# Altium project CAN2XG.PrjPcb
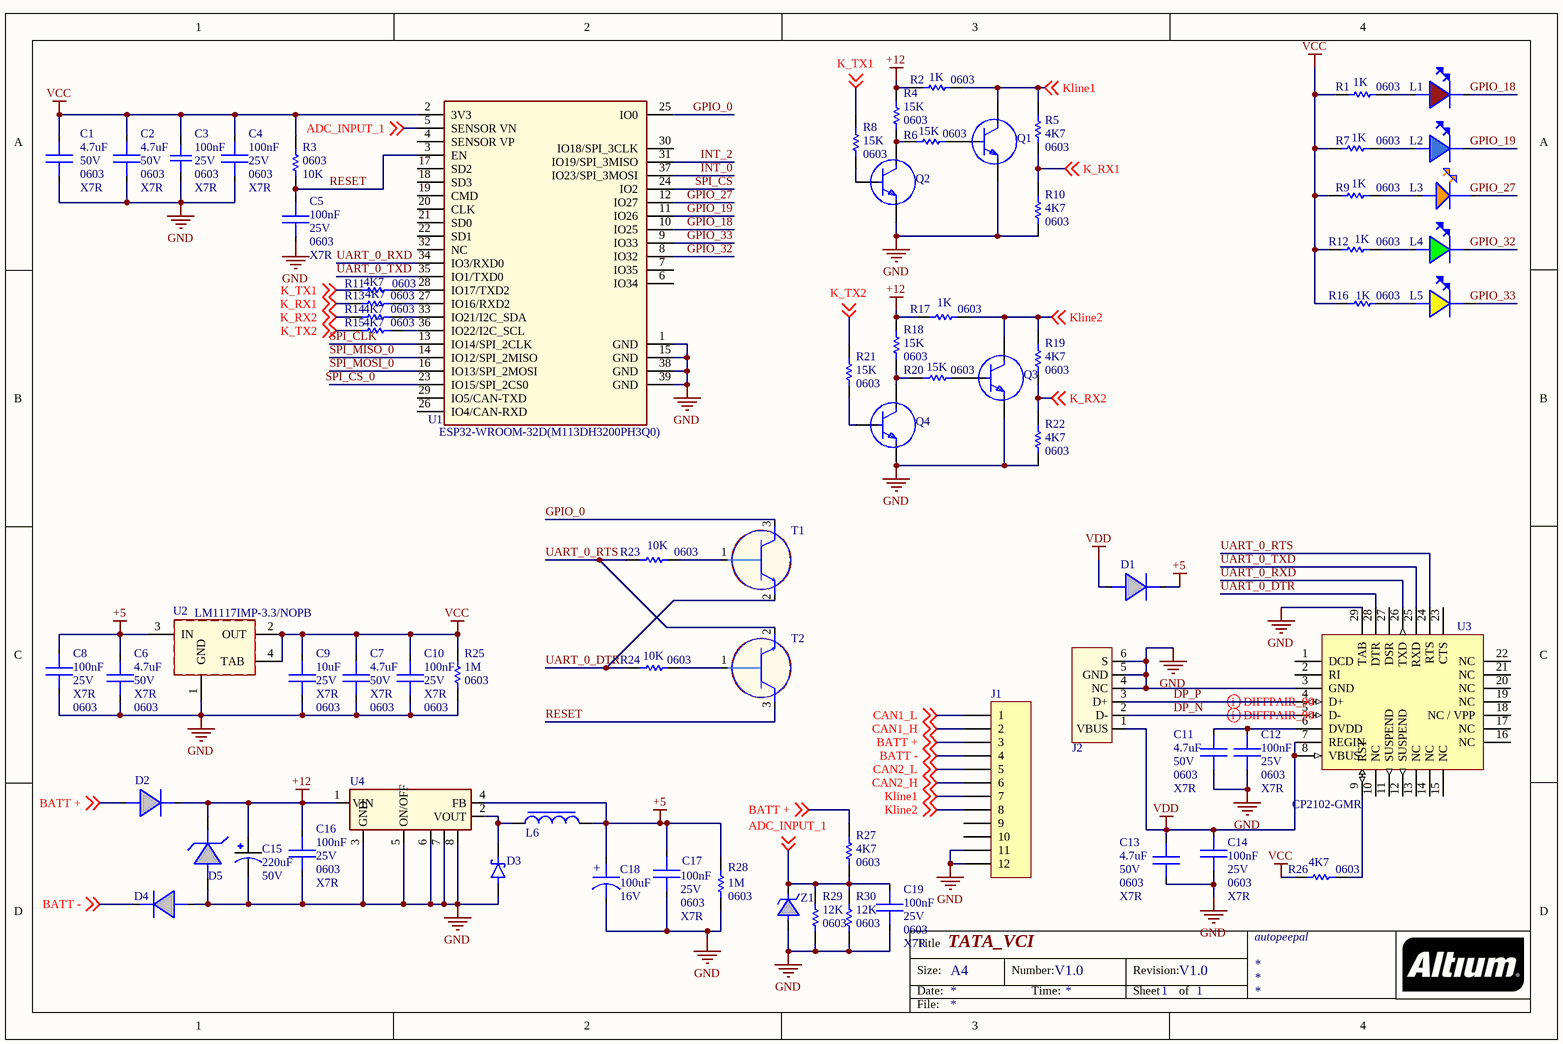
[diagram p0: CAN2XG.SchDoc]
2 sheets, 125 parts. Net scope: global (net labels, ports and power ports of the same name join across sheets).
Board file: CAN2XG.PcbDoc
Sheets:
  CAN2XG.SchDoc
  CAN2XG_TCAN.SchDoc

## Sheet CAN2XG.SchDoc: TATA_VCI
size A4; Organization: autopeepal; DocumentNumber: V1.0; Revision: V1.0; SheetNumber: 1; SheetTotal: 1

### Parts
C1  value 4.7uF  Voltage: 50V  Case/Package: 0603  Dielectric: X7R  [CAP-0603]
C2  value 4.7uF  Voltage: 50V  Case/Package: 0603  Dielectric: X7R  [CAP-0603]
C3  value 100nF  Dielectric: X7R  Case/Package: 0603  Voltage: 25V  [CAP-0603]
C4  value 100nF  Dielectric: X7R  Case/Package: 0603  Voltage: 25V  [CAP-0603]
C5  value 100nF  Voltage: 25V  Case/Package: 0603  Dielectric: X7R  [CAP-0603]
C6  value 4.7uF  Voltage: 50V  Case/Package: 0603  Dielectric: X7R  [CAP-0603]
C7  value 4.7uF  Voltage: 50V  Case/Package: 0603  Dielectric: X7R  [CAP-0603]
C8  value 100nF  Voltage: 25V  Dielectric: X7R  Case/Package: 0603  [CAP-0603]
C9  value 10uF  Voltage: 25V  Case/Package: 0603  Dielectric: X7R  [CAP-0603]
C10  value 100nF  Case/Package: 0603  Dielectric: X7R  Voltage: 25V  [CAP-0603]
C11  value 4.7uF  Voltage: 50V  Case/Package: 0603  Dielectric: X7R  [CAP-0603]
C12  value 100nF  Voltage: 25V  Case/Package: 0603  Dielectric: X7R  [CAP-0603]
C13  value 4.7uF  Voltage: 50V  Case/Package: 0603  Dielectric: X7R  [CAP-0603]
C14  value 100nF  Voltage: 25V  Case/Package: 0603  Dielectric: X7R  [CAP-0603]
C15  value 220uF  Voltage: 50V  [C200uF 10x10.2]
C16  value 100nF  Voltage: 25V  Case/Package: 0603  Dielectric: X7R  [CAP-0603]
C17  value 100nF  Voltage: 25V  Case/Package: 0603  Dielectric: X7R  [CAP-0603]
C18  value 100uF  Voltage: 16V  [C100uF]
C19  value 100nF  Voltage: 25V  Case/Package: 0603  Dielectic: X7R  [CAP-0603]
D1  (no value)  [DO214]
D2  (no value)  [DO214]
D3  (no value)  [DO214]
D4  (no value)  [DO214]
D5  (no value)  [DO214]
J1  (no value)  [HDR1X12]
J2  (no value)  [1734035-2USB]
L1  (no value)  [LEDRED0603]
L2  (no value)  [LEDBLUE0603]
L3  (no value)  [LEDRED0603]
L4  (no value)  [LEDGREEN0603]
L5  (no value)  [LEDRED0603]
L6  (no value)  [IND-WE-PD 1050-10X10X5MM]
Q1  (no value)  [SOT95P245X93-3N]
Q2  (no value)  [SOT95P245X93-3N]
Q3  (no value)  [SOT95P245X93-3N]
Q4  (no value)  [SOT95P245X93-3N]
R1  value 1K  Case/Package: 0603  [RESC1608X55X30ML15T15]
R2  value 1K  Case/Package: 0603  [RESC1608X55X30ML15T15]
R3  value 10K  Case/Package: 0603  [RESC1608X55X30ML15T15]
R4  value 15K  Case/Package: 0603  [RESC1608X55X30ML15T15]
R5  value 4K7  Case/Package: 0603  [RESC1608X55X30ML15T15]
R6  value 15K  Case/Package: 0603  [RESC1608X55X30ML15T15]
R7  value 1K  Case/Package: 0603  [RESC1608X55X30ML15T15]
R8  value 15K  Case/Package: 0603  [RESC1608X55X30ML15T15]
R9  value 1K  Case/Package: 0603  [RESC1608X55X30ML15T15]
R10  value 4K7  Case/Package: 0603  [RESC1608X55X30ML15T15]
R11  value 4K7  Case/Package: 0603  [RESC1608X55X30ML15T15]
R12  value 1K  Case/Package: 0603  [RESC1608X55X30ML15T15]
R13  value 4K7  Case/Package: 0603  [RESC1608X55X30ML15T15]
R14  value 4K7  Case/Package: 0603  [RESC1608X55X30ML15T15]
R15  value 4K7  Case/Package: 0603  [RESC1608X55X30ML15T15]
R16  value 1K  Case/Package: 0603  [RESC1608X55X30ML15T15]
R17  value 1K  Case/Package: 0603  [RESC1608X55X30ML15T15]
R18  value 15K  Case/Package: 0603  [RESC1608X55X30ML15T15]
R19  value 4K7  Case/Package: 0603  [RESC1608X55X30ML15T15]
R20  value 15K  Case/Package: 0603  [RESC1608X55X30ML15T15]
R21  value 15K  Case/Package: 0603  [RESC1608X55X30ML15T15]
R22  value 4K7  Case/Package: 0603  [RESC1608X55X30ML15T15]
R23  value 10K  Case/Package: 0603  [RESC1608X55X30ML15T15]
R24  value 10K  Case/Pacake: 0603  [RESC1608X55X30ML15T15]
R25  value 1M  Case/Package: 0603  [RESC1608X55X30ML15T15]
R26  value 4K7  Case/Package: 0603  [RESC1608X55X30ML15T15]
R27  value 4K7  Case/Package: 0603  [RESC1608X55X30ML15T15]
R28  value 1M  Case/Package: 0603  [RESC1608X55X30ML15T15]
R29  value 12K  Case/Package: 0603  [RESC1608X55X30ML15T15]
R30  value 12K  Case/Package: 0603  [RESC1608X55X30ML15T15]
T1  (no value)  [2N2222]
T2  (no value)  [2N2222]
U1  (no value)  [Espressif_Systems_ESP32-WROOM-32D_MFG]
U2  (no value)  [SOT223]
U3  (no value)  [QFN50P500X500X100_HS-29N]
U4  (no value)  [to-263]
Z1  (no value)  [SOD80]

### Nets
+5: C6.2 C8.2 C17.2 C18.1(+) D1.1(K) L6.2 R28.2 U2.3(IN) U4.4(FB)
+12: C15.1 C16.2 D2.1(K) D5.1(K) R2.2 R4.2 R17.2 R18.2 U4.1(VIN)
GND: C1.1 C2.1 C3.1 C4.1 C5.1 C6.1 C7.1 C8.1 C9.1 C10.1 C11.1 C12.1 C13.1 C14.1 C15.2 C16.1 C17.1 C18.2(-) C19.1 D3.2 D4.2(A) D5.2(A) J1.11 J1.12 J2.4(NC) J2.5(GND) J2.6(S) Q1.2(E) Q2.2(E) Q3.2(E) Q4.2(E) R10.1 R22.1 R25.1 R28.1 R29.1 R30.1 U1.1(GND) U1.15(GND) U1.38(GND) U1.39(GND) U2.1(GND) U3.3(GND) U3.29(TAB) U4.3(GND) U4.5(ON/OFF) U4.6 U4.7 U4.8 Z1.2(A)
VCC: C1.2 C2.2 C3.2 C4.2 C7.2 C9.2 C10.2 R1.1 R3.2 R7.1 R9.1 R12.1 R16.1 R25.2 R26.1 U1.2(3V3) U2.2(OUT) U2.4(TAB)
VDD: C13.2 C14.2 D1.2(A) J2.1(VBUS) U3.7(REGIN) U3.8(VBUS)
ADC_INPUT_1: C19.2 R27.1 R29.2 R30.2 U1.5(SENSOR_VN) Z1.1(K) ; off-sheet ADC_INPUT_1
BATT +: D2.2(A) J1.3 R27.2 ; off-sheet BATT +
BATT -: D4.1(K) J1.4 ; off-sheet BATT -
CAN1_H: J1.2 ; off-sheet CAN1_H
CAN1_L: J1.1 ; off-sheet CAN1_L
CAN2_H: J1.6 ; off-sheet CAN2_H
CAN2_L: J1.5 ; off-sheet CAN2_L
DP_N: J2.2(D-) U3.5(D-)
DP_P: J2.3(D+) U3.4(D+)
GPIO_0: T1.3(C) U1.25(IO0)
GPIO_18: L1.1(C) U1.10(IO25)
GPIO_19: L2.1(C) U1.11(IO26)
GPIO_27: L3.1(C) U1.12(IO27)
GPIO_32: L4.1(C) U1.8(IO32)
GPIO_33: L5.1(C) U1.9(IO33)
INT_0: U1.37(IO23/SPI_3MOSI)
INT_2: U1.31(IO19/SPI_3MISO)
K_RX1: R5.1 R10.2 R13.1 ; off-sheet K_RX1
K_RX2: R14.1 R19.1 R22.2 ; off-sheet K_RX2
K_TX1: R8.2 R11.1 ; off-sheet K_TX1
K_TX2: R15.1 R21.2 ; off-sheet K_TX2
Kline1: J1.7 Q1.3(C) R2.1 R5.2 ; off-sheet Kline1
Kline2: J1.8 Q3.3(C) R17.1 R19.2 ; off-sheet Kline2
RESET: C5.2 R3.1 T2.3(C) U1.3(EN)
SPI_CLK: U1.13(IO14/SPI_2CLK)
SPI_CS: U1.24(IO2)
SPI_CS_0: U1.23(IO15/SPI_2CS0)
SPI_MISO_0: U1.14(IO12/SPI_2MISO)
SPI_MOSI_0: U1.16(IO13/SPI_2MOSI)
UART_0_DTR: R24.2 T1.2(E) U3.28(DTR)
UART_0_RTS: R23.2 T2.2(E) U3.24(RTS)
UART_0_RXD: U1.34(IO3/RXD0) U3.26(TXD)
UART_0_TXD: U1.35(IO1/TXD0) U3.25(RXD)
NetC11_2: C11.2 C12.2 U3.6(DVDD)
NetD3_1: D3.1 L6.1 U4.2(VOUT)
NetL1_2: L1.2(A) R1.2
NetL2_2: L2.2(A) R7.2
NetL3_2: L3.2(A) R9.2
NetL4_2: L4.2(A) R12.2
NetL5_2: L5.2(A) R16.2
NetQ1_1: Q1.1(B) R6.1
NetQ2_1: Q2.1(B) R8.1
NetQ2_3: Q2.3(C) R4.1 R6.2
NetQ3_1: Q3.1(B) R20.1
NetQ4_1: Q4.1(B) R21.1
NetQ4_3: Q4.3(C) R18.1 R20.2
NetR11_2: R11.2 U1.28(IO17/TXD2)
NetR13_2: R13.2 U1.27(IO16/RXD2)
NetR14_2: R14.2 U1.33(IO21/I2C_SDA)
NetR15_2: R15.2 U1.36(IO22/I2C_SCL)
NetR23_1: R23.1 T1.1(B)
NetR24_1: R24.1 T2.1(B)
NetR26_2: R26.2 U3.9(RST)

Not connected (* = marked no-connect by the designer): J1 9 10; U1 4(SENSOR_VP) 6(IO34) 7(IO35) 17(SD2) 18(SD3) 19(CMD) 20(CLK) 21(SD0) 22(SD1) 26(IO4/CAN-RXD) 29(IO5/CAN-TXD) 30(IO18/SPI_3CLK) 32(NC); U3 1(DCD) 2(RI) 10(NC) 11(SUSPEND) 12(SUSPEND) 13(NC) 14(NC) 15(NC) 16(NC) 17(NC) 18(NC_/_VPP) 19(NC) 20(NC) 21(NC) 22(NC) 23(CTS) 27(DSR)

### Layout directives
differential pair; differential pair class 90: DP_P
differential pair; differential pair class 91: DP_N

### Notes on the sheet
- Title
- Size:
- Date:
- A4
- Number:
- Time:
- Revision:
- Sheet
- of
- File:

### Library data of the parts
C1 C2 C6 C7 C11 C13 = C4.7uF 0603: CAP CER 4.7uF 50V X7R 0603
C3 C5 = C1uF 0603: CAP CER 100nF 25V X7R 0603; Parameter 1: *
C4 C8 C10 C12 C14 C16 C17 C19 = C100nF 0603: CAP CER 100nF 25V X7R 0603
  C4 C8 C10 C16 C17 C19: Parameter 1: *
C9 = C10uF  0603: CAP CER 10uF 25V  0603
C15 = C200uF 10x10.2: 220uF 50V 10x10.5mm SMD Electrolytic Capacitor
C18 = C100uF: 100uF 16V (107C B3528) Tantalum
D1 = 1N4007: DO214 SMD Version of 1N4007 Forward Current: 1A Max Repititive Reverse Voltage: 1000 V Max RMS Voltage: 700V / Max DC Blocking Voltage: 1000V; ComponentLink1Description: Supplier Link; ComponentLink1URL: https://www.ktron.in/product/m7-diode-sma/; Manufacturer Part Number: 1N4007
D2 = 1N4007: DO214 SMD Version of 1N4007 Forward Current: 1A Max Repititive Reverse Voltage: 1000 V Max RMS Voltage: 700V  Max DC Blocking Voltage: 1000V Max instantaneous forward voltage: 1.1 V; ComponentLink1Description: Supplier Link; ComponentLink1URL: https://www.ktron.in/product/m7-diode-sma/; Maunfacturer Part Number: 1N4007
D3 = SS34-E3/57T: Schottky Diodes & Rectifiers 3.0 Amp 40 Volt; Manufacturer Part Number: SS34-E3/57T
D4 = 1N4007: DO214 SMD Version of 1N4007 Forward Current: 1A Max Repititive Reverse Voltage: 1000 V Max RMS Voltage: 700V Max DC Blocking Voltage: 1000V; ComponentLink1Description: Supplier Link; ComponentLink1URL: https://www.ktron.in/product/m7-diode-sma/; Manufacturer Part Number: 1N4007
D5 = SMBJ TVS Diode: ESD Protection Diodes / TVS Diodes 600W 200V 5% Uni-Directional; Manufature Part Number: SMBJ200A
J1 = Header 12: Header, 12-Pin
J2 = 1734035-2: CONN RCPT USB2.0 MINI B SMD R/A; Manufacturer Part number: 1734035-2
L1 = IN-S63ATR: LED RED CLEAR 0603 SMD; Case/Packahe: 0603; ComponentLink1URL: http://www.inolux-corp.com/datasheet/SMDLED/Mono%20Color%20Top%20View/IN-S63AT%20Series_V1.1.pdf?src-supplier=Digi-Key; ComponentLink1Description: http://www.inolux-corp.com/datasheet/SMDLED/Mono%20Color%20Top%20View/IN-S63AT%20Series_V1.1.pdf?src-supplier=Digi-Key; Manufacturer Part Number: IN-S63ATR
L2 = IN-S63AT5B: LED BLUE CLEAR 0603 SMD; ComponentLink1URL: http://www.inolux-corp.com/datasheet/SMDLED/Mono%20Color%20Top%20View/IN-S63AT%20Series_V1.1.pdf?src-supplier=Digi-Key; ComponentLink1Description: http://www.inolux-corp.com/datasheet/SMDLED/Mono%20Color%20Top%20View/IN-S63AT%20Series_V1.1.pdf?src-supplier=Digi-Key; Case/Package: 0603; Manufacturer Part Number: IN-S63AT5B
L3 = LED_Orange0603: LED ORANGE CLEAR 0603 SMD; Case/Packahe: 0603; Manufacturer Part Number: *
L4 = IN-S63AT5G: LED GREEN CLEAR 0603 SMD; Case/Packahe: 0603; ComponentLink1URL: http://www.inolux-corp.com/datasheet/SMDLED/Mono%20Color%20Top%20View/IN-S63AT%20Series_V1.1.pdf?src-supplier=Digi-Key; ComponentLink1Description: http://www.inolux-corp.com/datasheet/SMDLED/Mono%20Color%20Top%20View/IN-S63AT%20Series_V1.1.pdf?src-supplier=Digi-Key; Manufacturer Part Number: IN-S63AT5G
L5 = LED Y 0603: LED YELLOW CLEAR 0603 SMD; Manufacturer Part Number: IN-S63AT5Y; Case/Packahe: 0603
L6 = L68uH inductor: 68uH; Value: 68uH
Q1-Q4 = MMBT2222ALT1G: TRANS NPN 40V 0.6A SOT23-3; Case/Package: SOT-23-3; Manufacturer Part Number: MMBT2222ALT1G
  Q2-Q4: ComponentLink1URL: https://datasheet.ciiva.com/16199/mmbt2222lt1-d-16199072.pdf?src-supplier=Future+Electronics; ComponentLink1Description: https://datasheet.ciiva.com/16199/mmbt2222lt1-d-16199072.pdf?src-supplier=Future+Electronics; ComponentLink2URL: https://datasheet.ciiva.com/15139/getdatasheetpartid-82691-15139077.pdf?src-supplier=Verical; ComponentLink2Description: https://datasheet.ciiva.com/15139/getdatasheetpartid-82691-15139077.pdf?src-supplier=Verical; ComponentLink3URL: https://datasheet.ciiva.com/7972/mmbt2222lt1-d-7972057.pdf?src-supplier=Element14; ComponentLink3Description: https://datasheet.ciiva.com/7972/mmbt2222lt1-d-7972057.pdf?src-supplier=Element14; ComponentLink4URL: https://datasheet.ciiva.com/7972/mmbt2222lt1-d-7972058.pdf?src-supplier=Element14; ComponentLink4Description: https://datasheet.ciiva.com/7972/mmbt2222lt1-d-7972058.pdf?src-supplier=Element14; ComponentLink5URL: https://datasheet.ciiva.com/14546/70099528-14546715.pdf?src-supplier=Allied+Electronics; ComponentLink5Description: https://datasheet.ciiva.com/14546/70099528-14546715.pdf?src-supplier=Allied+Electronics; ComponentLink6URL: https://datasheet.ciiva.com/25998/mmbt2222lt1-d-25998815.pdf?src-supplier=Avnet+Europe; ComponentLink6Description: https://datasheet.ciiva.com/25998/mmbt2222lt1-d-25998815.pdf?src-supplier=Avnet+Europe; ComponentLink7URL: https://datasheet.ciiva.com/976/mmbt2222lt1-d-976344.pdf?src-supplier=Digi-Key; ComponentLink7Description: https://datasheet.ciiva.com/976/mmbt2222lt1-d-976344.pdf?src-supplier=Digi-Key; ComponentLink8URL: https://datasheet.ciiva.com/976/mmbt2222lt1-d-976345.pdf?src-supplier=Digi-Key; ComponentLink8Description: https://datasheet.ciiva.com/976/mmbt2222lt1-d-976345.pdf?src-supplier=Digi-Key; ComponentLink9URL: https://datasheet.ciiva.com/976/mmbt2222lt1-d-976346.pdf?src-supplier=Digi-Key; ComponentLink9Description: https://datasheet.ciiva.com/976/mmbt2222lt1-d-976346.pdf?src-supplier=Digi-Key; ComponentLink10URL: https://datasheet.ciiva.com/11201/mmbt2222lt1-d-11201869.pdf?src-supplier=Avnet; ComponentLink10Description: https://datasheet.ciiva.com/11201/mmbt2222lt1-d-11201869.pdf?src-supplier=Avnet
R1 R7 R9 R12 R16 = R1K 0603: Thick Film Resistor -  1K, 1%, 0603
R2 R17 = R1K 0603: Thick Film Resistor -  1K ohm, 1%, 0603
R3 = R10K 0603: Thick Film Resistor -  10Kohm, 1%, 0603
R4 R6 R8 R18 R20 R21 = R_15K: Thick Film Resistor -  15Kohm, 1%, 0603
R5 R10 R26 = R_4k7: Thick Film Resistor -  4K7 ohm, 1%, 0603
R11 R13-R15 = R_4k7: Thick Film Resistor -  4K7, 1%, 0603
R19 R22 = R_4k7: Thick Film Resistor -  4K7ohm, 1%, 0603
R23 R24 = R10K 0603: Thick Film Resistor -  10K, 1%, 0603
R25 R28 = R1MOhm 0603: Thick Film Resistor -  10M, 1%, 0603
R27 = R_47K: Thick Film Resistor -  4K7 ohm, 1%, 0603
R29 R30 = R12K 0603: Thick Film Resistor -  12K ohm, 1%, 0603
T1 T2 = MMBT2222: 2TRANS NPN 30V 0.6A SOT23-3; Manufacturer Part Number: MMBT2222
U1 = ESP32-WROOM-32D(M113DH3200PH3Q0): WiFi Modules (802.11) SMD Module, ESP32-D0WD, 32Mbits SPI 4MB flash, UART mode, PCB antenna; Manufacturer Part Number: ESP32-WROOM-32D(M113DH3200PH3Q0); ComponentLink1Description: Link; ComponentLink1URL: https://www.mouser.com/ProductDetail/Espressif-Systems/ESP32-WROOM-32D-N4?qs=Li%252BoUPsLEntUgv1ft2QYWQ%3D%3D
U2 = LM1117IMP-3.3/NOPB: LDO Voltage Regulators 800MA LDO LINEAR REG; Manufacturer Part Number: LM1117IMP-3.3/NOPB
U3 = CP2102-GMR: USB-to-UART 1-CH 640byte FIFO 3.3V Automotive 28-Pin QFN EP T/R; Manufacturer Part Number: CP2102-GMR
U4 = LM2596S-5.0/NOPB: Switching Voltage Regulators 150 KHZ 3A STEP-DOWN VLTG REG; Manufacturer Part Number: LM2596S-5.0/NOPB
Z1 = Zener5.1V: Zener Diode 5.1V / 500mW / 5% Tolerance / SMD Equivalent of BZX55C5V1; ComponentLink1Description: Supplier Link; ComponentLink1URL: https://www.ktron.in/product/zener-diode-5v1-500mw-sod-80-2/; Case/Package: SOD-80-2; Voltage: 5.1V

## Sheet CAN2XG_TCAN.SchDoc
size 431 x 279 mm; Organization: ORGANIZATION; Address1: ADDRESS 1; Address2: ADDRESS 2; Address3: ADDRESS 3; Address4: ADDRESS 4; Revision: -; ENG_APP_DATE: --/--/--; DSN_APP_DATE: --/--/--; CHK_APP_DATE: --/--/--
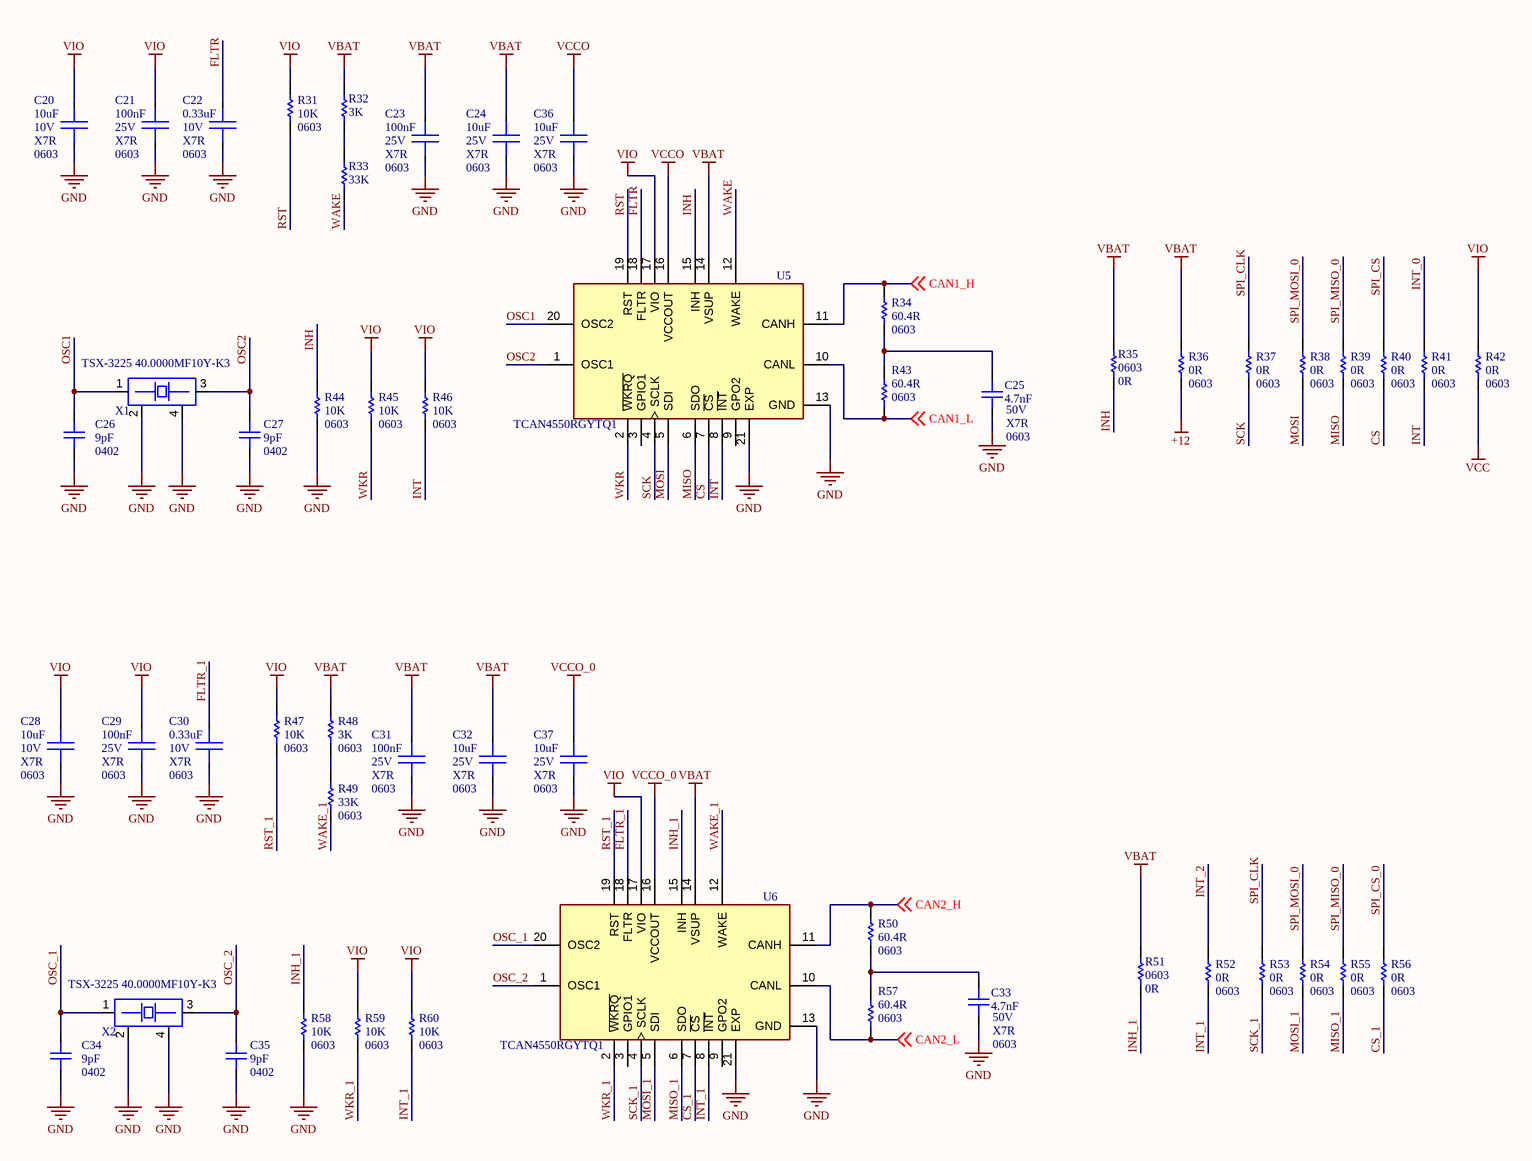
[diagram p1: CAN2XG_TCAN.SchDoc]

### Parts
C20  value 10uF  Voltage: 10V  Dielectirc: X7R  Case/Package: 0603  [CAP-0603]
C21  value 100nF  Voltage: 25V  Dielectirc: X7R  Case/Package: 0603  [CAP-0603]
C22  value 0.33uF  Voltage: 10V  Dielectirc: X7R  Case/Package: 0603  [CAP-0603]
C23  value 100nF  Voltage: 25V  Dielectirc: X7R  Case/Package: 0603  [CAP-0603]
C24  value 10uF  Voltage: 25V  Dielectirc: X7R  Case/Package: 0603  [CAP-0603]
C25  value 4.7nF  Voltage: 50V  Dielectric: X7R  Case/Package: 0603  [CAP-0603]
C26  value 9pF  Case/Package: 0402  [CAPC0402]
C27  value 9pF  Case/Package: 0402  [CAPC0402]
C28  value 10uF  Voltage: 10V  Dielectirc: X7R  Case/Package: 0603  [CAP-0603]
C29  value 100nF  Voltage: 25V  Dielectirc: X7R  Case/Package: 0603  [CAP-0603]
C30  value 0.33uF  Voltage: 10V  Dielectirc: X7R  Case/Package: 0603  [CAP-0603]
C31  value 100nF  Voltage: 25V  Dielectirc: X7R  Case/Package: 0603  [CAP-0603]
C32  value 10uF  Voltage: 25V  Dielectirc: X7R  Case/Package: 0603  [CAP-0603]
C33  value 4.7nF  Voltage: 50V  Dielectric: X7R  Case/Package: 0603  [CAP-0603]
C34  value 9pF  Case/Package: 0402  [CAPC0402]
C35  value 9pF  Case/Package: 0402  [CAPC0402]
C36  value 10uF  Voltage: 25V  Dielectirc: X7R  Case/Package: 0603  [CAP-0603]
C37  value 10uF  Voltage: 25V  Dielectirc: X7R  Case/Package: 0603  [CAP-0603]
R31  value 10K  Case/Package: 0603  [RESC0603]
R32  value 3K  [RESC0603]
R33  value 33K  [RESC0603]
R34  value 60.4R  Case/Package: 0603  [RESC0603]
R35  value 0R  Case/Package: 0603  [RESC0603]  (no BOM)
R36  value 0R  Case/Package: 0603  [RESC0603]
R37  value 0R  Case/Package: 0603  [RESC0603]
R38  value 0R  Case/Package: 0603  [RESC0603]
R39  value 0R  Case/Package: 0603  [RESC0603]
R40  value 0R  Case/Package: 0603  [RESC0603]
R41  value 0R  Case/Package: 0603  [RESC0603]
R42  value 0R  Case/Package: 0603  [RESC0603]
R43  value 60.4R  Case/Package: 0603  [RESC0603]
R44  value 10K  Case/Package: 0603  [RESC0603]
R45  value 10K  Case/Package: 0603  [RESC0603]
R46  value 10K  Case/Package: 0603  [RESC0603]
R47  value 10K  Case/Package: 0603  [RESC0603]
R48  value 3K  Case/Package: 0603  [RESC0603]
R49  value 33K  Case/Package: 0603  [RESC0603]
R50  value 60.4R  Case/Package: 0603  [RESC0603]
R51  value 0R  Case/Package: 0603  [RESC0603]  (no BOM)
R52  value 0R  Case/Package: 0603  [RESC0603]
R53  value 0R  Case/Package: 0603  [RESC0603]
R54  value 0R  Case/Package: 0603  [RESC0603]
R55  value 0R  Case/Package: 0603  [RESC0603]
R56  value 0R  Case/Package: 0603  [RESC0603]
R57  value 60.4R  Case/Package: 0603  [RESC0603]
R58  value 10K  Case/Package: 0603  [RESC0603]
R59  value 10K  Case/Package: 0603  [RESC0603]
R60  value 10K  Case/Package: 0603  [RESC0603]
U5  (no value)  [IC_TCAN4550RGYTQ1]
U6  (no value)  [IC_TCAN4550RGYTQ1]
X1  Manufacturer Part Number: TSX-3225 40.0000MF10Y-K3  [Crystal_3225]
X2  Manufacturer Part Number: TSX-3225 40.0000MF10Y-K3  [Crystal_3225]

### Nets
+12: R36.1
GND: C20.1 C21.1 C22.1 C23.1 C24.1 C25.1 C26.1 C27.1 C28.1 C29.1 C30.1 C31.1 C32.1 C33.1 C34.1 C35.1 C36.1 C37.1 R44.1 R58.1 U5.13(GND) U5.21(EXP) U6.13(GND) U6.21(EXP) X1.2 X1.4 X2.2 X2.4
VBAT: C23.2 C24.2 C31.2 C32.2 R32.2 R35.1 R36.2 R48.2 R51.1 U5.14(VSUP) U6.14(VSUP)
VCC: R42.1
VCCO: C36.2 U5.16(VCCOUT)
VCCO_0: C37.2 U6.16(VCCOUT)
VIO: C20.2 C21.2 C28.2 C29.2 R31.2 R42.2 R45.2 R46.2 R47.2 R59.2 R60.2 U5.17(VIO) U6.17(VIO)
CAN1_H: R34.2 U5.11(CANH) ; off-sheet CAN1_H
CAN1_L: R43.1 U5.10(CANL) ; off-sheet CAN1_L
CAN2_H: R50.2 U6.11(CANH) ; off-sheet CAN2_H
CAN2_L: R57.1 U6.10(CANL) ; off-sheet CAN2_L
CS: R40.1 U5.7(~{CS})
CS_1: R56.1 U6.7(~{CS})
FLTR: C22.2 U5.18(FLTR)
FLTR_1: C30.2 U6.18(FLTR)
INH: R35.2 R44.2 U5.15(INH)
INH_1: R51.2 R58.2 U6.15(INH)
INT: R41.1 R46.1 U5.8(~{INT})
INT_0: R41.2
INT_1: R52.1 R60.1 U6.8(~{INT})
INT_2: R52.2
MISO: R39.1 U5.6(SDO)
MISO_1: R55.1 U6.6(SDO)
MOSI: R38.1 U5.5(SDI)
MOSI_1: R54.1 U6.5(SDI)
OSC1: C26.2 U5.20(OSC2) X1.1
OSC2: C27.2 U5.1(OSC1) X1.3
OSC_1: C34.2 U6.20(OSC2) X2.1
OSC_2: C35.2 U6.1(OSC1) X2.3
RST: R31.1 U5.19(RST)
RST_1: R47.1 U6.19(RST)
SCK: R37.1 U5.4(SCLK)
SCK_1: R53.1 U6.4(SCLK)
SPI_CLK: R37.2 R53.2
SPI_CS: R40.2
SPI_CS_0: R56.2
SPI_MISO_0: R39.2 R55.2
SPI_MOSI_0: R38.2 R54.2
WAKE: R33.1 U5.12(WAKE)
WAKE_1: R49.1 U6.12(WAKE)
WKR: R45.1 U5.2(~{WKRQ})
WKR_1: R59.1 U6.2(~{WKRQ})
NetC25_2: C25.2 R34.1 R43.2
NetC33_2: C33.2 R50.1 R57.2
NetR32_1: R32.1 R33.2
NetR48_1: R48.1 R49.2

Not connected (* = marked no-connect by the designer): U5 3(GPIO1) 9(GPO2); U6 3(GPIO1) 9(GPO2)

### Notes on the sheet
- DWG. NO.
- REV.
- SHT.
- THIS DOCUMENT AND THE DATA DISCLOSED HEREIN OR HEREWITH IS THE PROPERTY OF ALTIUM LIMITED AND MAY BE FREELY DISTRIBUTED IN WHOLE. NO RIGHTS ARE RESERVED OR EXPRESS OR IMPLIED WARANTEE GIVEN.
- REVISION
- DESCRIPTION
- DATE
- APPROVED
- ENG:
- APPROVALS
- PROJECT
- DSN:
- CHK:
- REFERENCE DOCUMENTS
- PROJECT REVISION:
- TITLE
- DOCUMENT REVISION:
- DESIGN ITEM:
- BOM:
- FAB DWG:
- PCB DWG:
- ASSY DWG:
- SCALE:
- SIZE
- B
- CAGE CODE
- FILE NAME
- DWG NO.
- SHEET
- OF
- REV

### Library data of the parts
C20 C24 C28 C32 C36 C37 = C10uF  0603: CAP CER 10uF 25V  0603
C21 C23 C29 C31 = C10uF  0603: CAP CER 100nF 25V X7R 0603
C22 C30 = C10uF  0603: CAP CER 0.33uF 10V  0603
C25 C33 = CS0805KRX7RYBB472: CAP CER 4.7nF 50V X7R 0603; ComponentLink1URL: https://datasheet.ciiva.com/204/cx7r-204728.pdf?src-supplier=Digi-Key; ComponentLink1Description: https://datasheet.ciiva.com/204/cx7r-204728.pdf?src-supplier=Digi-Key; ComponentLink2URL: https://datasheet.ciiva.com/5418/cx7r-218113-5418187.pdf?src-supplier=Mouser; ComponentLink2Description: https://datasheet.ciiva.com/5418/cx7r-218113-5418187.pdf?src-supplier=Mouser
C26 C27 C34 C35 = CQ0805BRNPOYBN8R2: CAP CER 9PF 50V X7R 0402; ComponentLink1URL: https://datasheet.ciiva.com/204/cx7r-204728.pdf?src-supplier=Digi-Key; ComponentLink1Description: https://datasheet.ciiva.com/204/cx7r-204728.pdf?src-supplier=Digi-Key; ComponentLink2URL: https://datasheet.ciiva.com/5418/cx7r-218113-5418187.pdf?src-supplier=Mouser; ComponentLink2Description: https://datasheet.ciiva.com/5418/cx7r-218113-5418187.pdf?src-supplier=Mouser; Voltage: 50V
R31 R44-R47 R58-R60 = ERJ6ENF1002V: Thick Film Resistor -  10K, 1%, 0603
  R45 R46 R59 R60: ComponentLink1URL: https://datasheet.ciiva.com/11808/0900766b80f80784-11808080.pdf?src-supplier=RSComponents; ComponentLink1Description: https://datasheet.ciiva.com/11808/0900766b80f80784-11808080.pdf?src-supplier=RSComponents; ComponentLink2URL: https://datasheet.ciiva.com/16514/aoa0000ce2-16514021.pdf?src-supplier=Avnet+Asia; ComponentLink2Description: https://datasheet.ciiva.com/16514/aoa0000ce2-16514021.pdf?src-supplier=Avnet+Asia; ComponentLink3URL: https://datasheet.ciiva.com/27055/1988971-27055733.pdf?src-supplier=Jameco; ComponentLink3Description: https://datasheet.ciiva.com/27055/1988971-27055733.pdf?src-supplier=Jameco; ComponentLink4URL: https://datasheet.ciiva.com/16759/70260748-16759350.pdf?src-supplier=Allied+Electronics; ComponentLink4Description: https://datasheet.ciiva.com/16759/70260748-16759350.pdf?src-supplier=Allied+Electronics; ComponentLink5URL: https://datasheet.ciiva.com/16725/70260748-16725031.pdf?src-supplier=Allied+Electronics; ComponentLink5Description: https://datasheet.ciiva.com/16725/70260748-16725031.pdf?src-supplier=Allied+Electronics; ComponentLink6URL: https://datasheet.ciiva.com/7830/426256-7830745.pdf?src-supplier=Element14; ComponentLink6Description: https://datasheet.ciiva.com/7830/426256-7830745.pdf?src-supplier=Element14; ComponentLink7URL: https://datasheet.ciiva.com/46372/1678782-46372714.pdf?src-supplier=Element14; ComponentLink7Description: https://datasheet.ciiva.com/46372/1678782-46372714.pdf?src-supplier=Element14; ComponentLink8URL: https://datasheet.ciiva.com/46372/1678782-46372715.pdf?src-supplier=Element14; ComponentLink8Description: https://datasheet.ciiva.com/46372/1678782-46372715.pdf?src-supplier=Element14; ComponentLink9URL: https://datasheet.ciiva.com/17212/aoa0000ce2-17212108.pdf?src-supplier=Avnet+Europe; ComponentLink9Description: https://datasheet.ciiva.com/17212/aoa0000ce2-17212108.pdf?src-supplier=Avnet+Europe; ComponentLink10URL: https://datasheet.ciiva.com/30140/aoa0000ce2-30140236.pdf?src-supplier=Onlinecomponents.com; ComponentLink10Description: https://datasheet.ciiva.com/30140/aoa0000ce2-30140236.pdf?src-supplier=Onlinecomponents.com
R32 R48 = ERJ6ENF1002V: Thick Film Resistor -  3K, 1%, 0603
  R32: Case/Package: 0603; Parameter 1: *
  R48: ComponentLink1URL: https://datasheet.ciiva.com/11808/0900766b80f80784-11808080.pdf?src-supplier=RSComponents; ComponentLink1Description: https://datasheet.ciiva.com/11808/0900766b80f80784-11808080.pdf?src-supplier=RSComponents; ComponentLink2URL: https://datasheet.ciiva.com/16514/aoa0000ce2-16514021.pdf?src-supplier=Avnet+Asia; ComponentLink2Description: https://datasheet.ciiva.com/16514/aoa0000ce2-16514021.pdf?src-supplier=Avnet+Asia; ComponentLink3URL: https://datasheet.ciiva.com/27055/1988971-27055733.pdf?src-supplier=Jameco; ComponentLink3Description: https://datasheet.ciiva.com/27055/1988971-27055733.pdf?src-supplier=Jameco; ComponentLink4URL: https://datasheet.ciiva.com/16759/70260748-16759350.pdf?src-supplier=Allied+Electronics; ComponentLink4Description: https://datasheet.ciiva.com/16759/70260748-16759350.pdf?src-supplier=Allied+Electronics; ComponentLink5URL: https://datasheet.ciiva.com/16725/70260748-16725031.pdf?src-supplier=Allied+Electronics; ComponentLink5Description: https://datasheet.ciiva.com/16725/70260748-16725031.pdf?src-supplier=Allied+Electronics; ComponentLink6URL: https://datasheet.ciiva.com/7830/426256-7830745.pdf?src-supplier=Element14; ComponentLink6Description: https://datasheet.ciiva.com/7830/426256-7830745.pdf?src-supplier=Element14; ComponentLink7URL: https://datasheet.ciiva.com/46372/1678782-46372714.pdf?src-supplier=Element14; ComponentLink7Description: https://datasheet.ciiva.com/46372/1678782-46372714.pdf?src-supplier=Element14; ComponentLink8URL: https://datasheet.ciiva.com/46372/1678782-46372715.pdf?src-supplier=Element14; ComponentLink8Description: https://datasheet.ciiva.com/46372/1678782-46372715.pdf?src-supplier=Element14; ComponentLink9URL: https://datasheet.ciiva.com/17212/aoa0000ce2-17212108.pdf?src-supplier=Avnet+Europe; ComponentLink9Description: https://datasheet.ciiva.com/17212/aoa0000ce2-17212108.pdf?src-supplier=Avnet+Europe; ComponentLink10URL: https://datasheet.ciiva.com/30140/aoa0000ce2-30140236.pdf?src-supplier=Onlinecomponents.com; ComponentLink10Description: https://datasheet.ciiva.com/30140/aoa0000ce2-30140236.pdf?src-supplier=Onlinecomponents.com
R33 R49 = ERJ6ENF1002V: Thick Film Resistor -  33K, 1%, 0603
  R33: ComponentLink1URL: https://datasheet.ciiva.com/11808/0900766b80f80784-11808080.pdf?src-supplier=RSComponents; ComponentLink1Description: https://datasheet.ciiva.com/11808/0900766b80f80784-11808080.pdf?src-supplier=RSComponents; ComponentLink2URL: https://datasheet.ciiva.com/16514/aoa0000ce2-16514021.pdf?src-supplier=Avnet+Asia; ComponentLink2Description: https://datasheet.ciiva.com/16514/aoa0000ce2-16514021.pdf?src-supplier=Avnet+Asia; ComponentLink3URL: https://datasheet.ciiva.com/27055/1988971-27055733.pdf?src-supplier=Jameco; ComponentLink3Description: https://datasheet.ciiva.com/27055/1988971-27055733.pdf?src-supplier=Jameco; ComponentLink4URL: https://datasheet.ciiva.com/16759/70260748-16759350.pdf?src-supplier=Allied+Electronics; ComponentLink4Description: https://datasheet.ciiva.com/16759/70260748-16759350.pdf?src-supplier=Allied+Electronics; ComponentLink5URL: https://datasheet.ciiva.com/16725/70260748-16725031.pdf?src-supplier=Allied+Electronics; ComponentLink5Description: https://datasheet.ciiva.com/16725/70260748-16725031.pdf?src-supplier=Allied+Electronics; ComponentLink6URL: https://datasheet.ciiva.com/7830/426256-7830745.pdf?src-supplier=Element14; ComponentLink6Description: https://datasheet.ciiva.com/7830/426256-7830745.pdf?src-supplier=Element14; ComponentLink7URL: https://datasheet.ciiva.com/46372/1678782-46372714.pdf?src-supplier=Element14; ComponentLink7Description: https://datasheet.ciiva.com/46372/1678782-46372714.pdf?src-supplier=Element14; ComponentLink8URL: https://datasheet.ciiva.com/46372/1678782-46372715.pdf?src-supplier=Element14; ComponentLink8Description: https://datasheet.ciiva.com/46372/1678782-46372715.pdf?src-supplier=Element14; ComponentLink9URL: https://datasheet.ciiva.com/17212/aoa0000ce2-17212108.pdf?src-supplier=Avnet+Europe; ComponentLink9Description: https://datasheet.ciiva.com/17212/aoa0000ce2-17212108.pdf?src-supplier=Avnet+Europe; ComponentLink10URL: https://datasheet.ciiva.com/30140/aoa0000ce2-30140236.pdf?src-supplier=Onlinecomponents.com; ComponentLink10Description: https://datasheet.ciiva.com/30140/aoa0000ce2-30140236.pdf?src-supplier=Onlinecomponents.com; Case/Package: 0603; Parameter 1: *
R34 R43 R50 R57 = RC0805FR-0760R4L: Thick Film Resistor -  60.4R, 1%, 0603; ComponentLink1URL: https://industrial.panasonic.com/sa/system/files/data/download/catalog/id_fixed-resistors_e_2.pdf?src-supplier=Digi-Key; ComponentLink1Description: https://industrial.panasonic.com/sa/system/files/data/download/catalog/id_fixed-resistors_e_2.pdf?src-supplier=Digi-Key; ComponentLink2URL: https://industrial.panasonic.com/cdbs/www-data/pdf/RDM0000/DMM0000COL5.pdf?src-supplier=Digi-Key; ComponentLink2Description: https://industrial.panasonic.com/cdbs/www-data/pdf/RDM0000/DMM0000COL5.pdf?src-supplier=Digi-Key
R35-R42 R51-R56 = RC0805FR-0760R4L: Thick Film Resistor -  0R , 1%, 0603; ComponentLink1URL: https://industrial.panasonic.com/sa/system/files/data/download/catalog/id_fixed-resistors_e_2.pdf?src-supplier=Digi-Key; ComponentLink1Description: https://industrial.panasonic.com/sa/system/files/data/download/catalog/id_fixed-resistors_e_2.pdf?src-supplier=Digi-Key; ComponentLink2URL: https://industrial.panasonic.com/cdbs/www-data/pdf/RDM0000/DMM0000COL5.pdf?src-supplier=Digi-Key; ComponentLink2Description: https://industrial.panasonic.com/cdbs/www-data/pdf/RDM0000/DMM0000COL5.pdf?src-supplier=Digi-Key
U5 U6 = TCAN4550RGYTQ1: Automotive system basis chip (SBC) with integrated CAN FD controller & transceiver 20-VQFN -40 to 125; Package: None; Price: None; Value: *; Manufacturer Part Number: TCAN4550RGYTQ1; Availability: Unavailable
X1 X2 = CRYSTAL_1: CRYSTAL 40.0000MHZ 10PF SMD

## Nets that join several sheets
+12: CAN2XG (9 pins), CAN2XG_TCAN (R36.1)
GND: CAN2XG (50 pins), CAN2XG_TCAN (28 pins)
VCC: CAN2XG (18 pins), CAN2XG_TCAN (R42.1)
CAN1_H: CAN2XG (J1.2), CAN2XG_TCAN (R34.2 U5.11)
CAN1_L: CAN2XG (J1.1), CAN2XG_TCAN (R43.1 U5.10)
CAN2_H: CAN2XG (J1.6), CAN2XG_TCAN (R50.2 U6.11)
CAN2_L: CAN2XG (J1.5), CAN2XG_TCAN (R57.1 U6.10)
INT_0: CAN2XG (U1.37), CAN2XG_TCAN (R41.2)
INT_2: CAN2XG (U1.31), CAN2XG_TCAN (R52.2)
SPI_CLK: CAN2XG (U1.13), CAN2XG_TCAN (R37.2 R53.2)
SPI_CS: CAN2XG (U1.24), CAN2XG_TCAN (R40.2)
SPI_CS_0: CAN2XG (U1.23), CAN2XG_TCAN (R56.2)
SPI_MISO_0: CAN2XG (U1.14), CAN2XG_TCAN (R39.2 R55.2)
SPI_MOSI_0: CAN2XG (U1.16), CAN2XG_TCAN (R38.2 R54.2)